# EAGLE design BespokeToast_Rev-0_v77 (EAGLE 9.7.0)

## Sheet 1 of 4: POWER SUPPLY
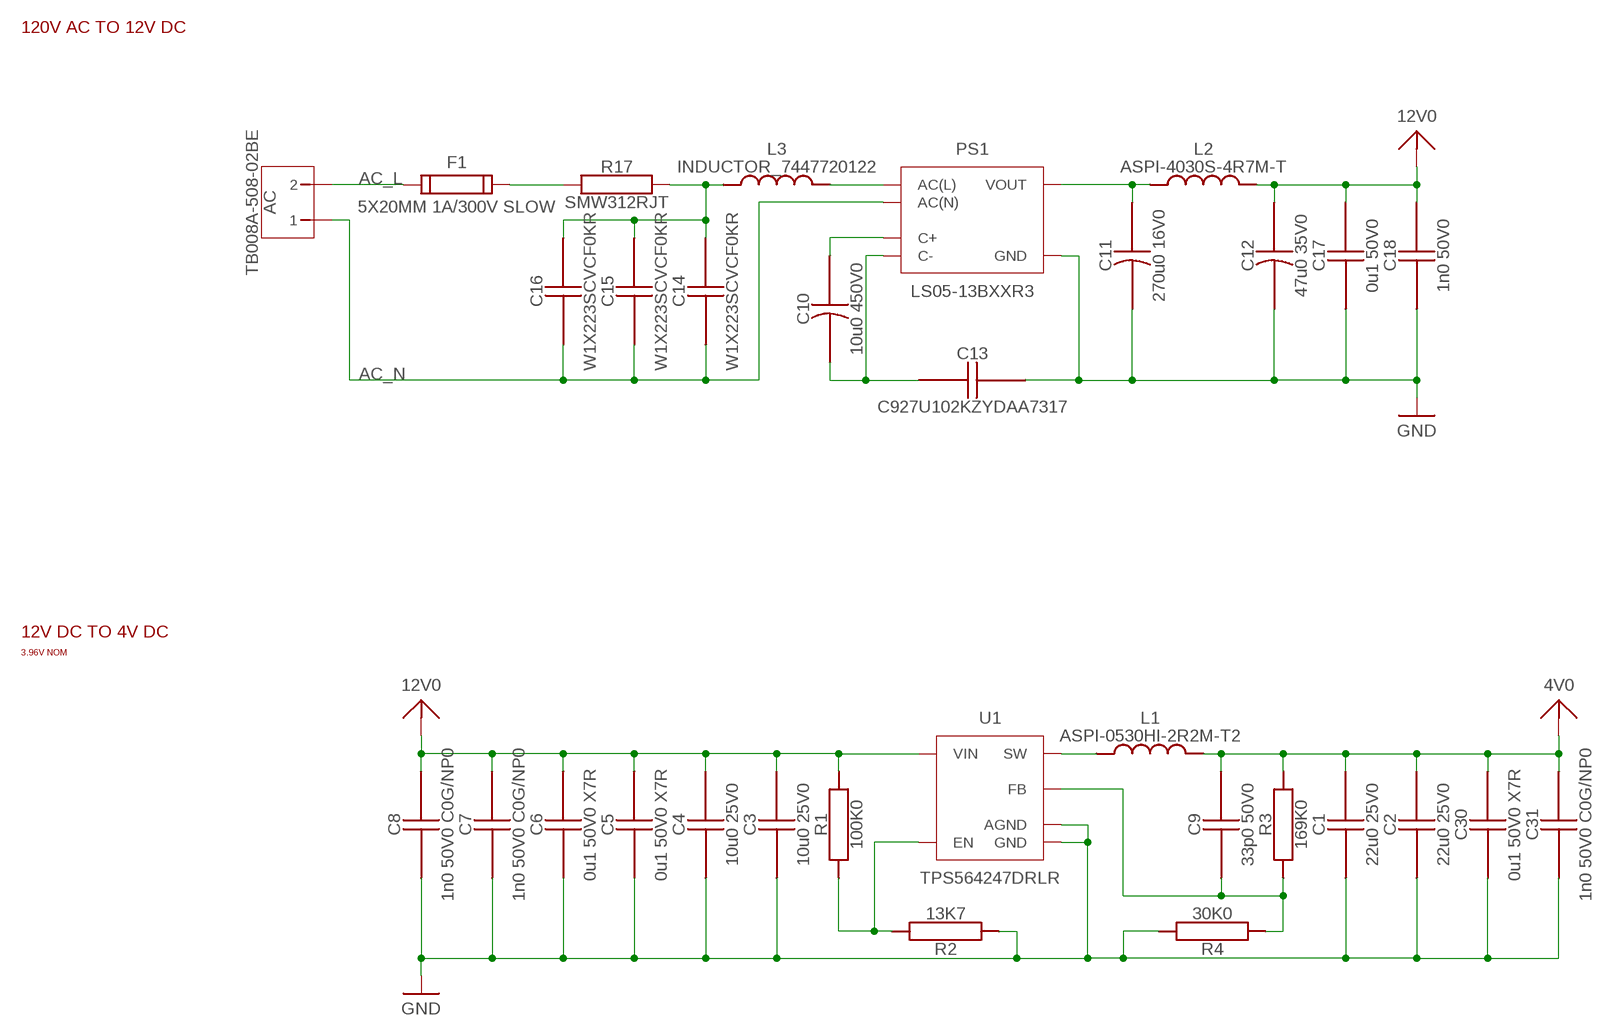
[diagram p0: schematic, sheet 1]

### Parts
AC  TB008A-508-02BE  [TB008A-508-02BE]
C1  22u0 25V0  CAP-NON-POL_SAMSUNG-0805  [SAMSUNG_CAP-0805]
C2  22u0 25V0  CAP-NON-POL_SAMSUNG-0805  [SAMSUNG_CAP-0805]
C3  10u0 25V0  CAP-NON-POL_SAMSUNG-0805  [SAMSUNG_CAP-0805]
C4  10u0 25V0  CAP-NON-POL_SAMSUNG-0805  [SAMSUNG_CAP-0805]
C5  0u1 50V0 X7R  CAP-NON-POL_SAMSUNG-0402  [SAMSUNG_CAP-0402]
C6  0u1 50V0 X7R  CAP-NON-POL_SAMSUNG-0402  [SAMSUNG_CAP-0402]
C7  1n0 50V0 C0G/NP0  CAP-NON-POL_SAMSUNG-0402  [SAMSUNG_CAP-0402]
C8  1n0 50V0 C0G/NP0  CAP-NON-POL_SAMSUNG-0402  [SAMSUNG_CAP-0402]
C9  33p0 50V0  CAP-NON-POL_SAMSUNG-0402  [SAMSUNG_CAP-0402]
C10  10u0 450V0  CAP-POL_RUBYCON_CAP-POL-5X10  [RUBYCON_CAP-POL-5X10]
C11  270u0 16V0  CAP-POL_RUBYCON_CAP-POL-3.5X8  [RUBYCON_CAP-POL-3.5X8]
C12  47u0 35V0  CAP-POL_RUBYCON_CAP-POL-3.5X8  [RUBYCON_CAP-POL-3.5X8]
C13  C927U102KZYDAA7317  CAP-NON-POL_TC_CAP-7.5  [TH_CAP-7.5]
C14  W1X223SCVCF0KR  CAP-NON-POL_TC_CAP-7.5  [TH_CAP-7.5]
C15  W1X223SCVCF0KR  CAP-NON-POL_TC_CAP-7.5  [TH_CAP-7.5]
C16  W1X223SCVCF0KR  CAP-NON-POL_TC_CAP-7.5  [TH_CAP-7.5]
C17  0u1 50V0  CAP-NON-POL_SAMSUNG-0402  [SAMSUNG_CAP-0402]
C18  1n0 50V0  CAP-NON-POL_SAMSUNG-0402  [SAMSUNG_CAP-0402]
C30  0u1 50V0 X7R  CAP-NON-POL_SAMSUNG-0402  [SAMSUNG_CAP-0402]
C31  1n0 50V0 C0G/NP0  CAP-NON-POL_SAMSUNG-0402  [SAMSUNG_CAP-0402]
F1  5X20MM 1A/300V SLOW  FUSE_FC-203-22-5X20MM  [FC-203-22]
L1  ASPI-0530HI-2R2M-T2  INDUCTOR_ASPI-0530HI-2R2M-T2  [ASPI-0530HI-2R2M-T2]
L2  ASPI-4030S-4R7M-T  INDUCTOR_ASPI-4030S-4R7M-T  [ASPI-4030S-4R7M-T]
L3  INDUCTOR_7447720122  [7447720122]
PS1  LS05-13BXXR3  [LS05-13BXXR3]
R1  100K0  RES-CHIP_YAGEO-0402  [YAGEO_RES-0402]
R2  13K7  RES-CHIP_YAGEO-0402  [YAGEO_RES-0402]
R3  169K0  RES-CHIP_YAGEO-0402  [YAGEO_RES-0402]
R4  30K0  RES-CHIP_YAGEO-0402  [YAGEO_RES-0402]
R17  SMW312RJT  [SMW312RJT]
U1  TPS564247DRLR  [TPS564247DRLR]

### Nets
4V0: C1.P$2 C2.P$2 C9.P$2 C30.P$2 C31.P$2 L1.P$2 R3.P$2 ; supply symbol labelled SYM-4V0 ; also sheet 3,4
12V0: C3.P$2 C4.P$2 C5.P$2 C6.P$2 C7.P$2 C8.P$2 C12.+ C17.P$2 C18.P$2 L2.P$2 R1.P$2 U1.P$1(VIN) ; supply symbol labelled SYM-12V0 ; also sheet 2
AC_L: AC.P$2 F1.P$1 F1.P$2 ; also sheet 2
AC_N: AC.P$1 C14.P$1 C15.P$1 C16.P$1 PS1.P$2(AC(N)) ; also sheet 2
GND: C1.P$1 C2.P$1 C3.P$1 C4.P$1 C5.P$1 C6.P$1 C7.P$1 C8.P$1 C11.- C12.- C13.P$2 C17.P$1 C18.P$1 C30.P$1 C31.P$1 PS1.P$5(GND) R2.P$1 R4.P$2 U1.P$3(GND) U1.P$4(AGND) ; supply symbol labelled SYM-GND ; also sheet 2,3,4
N$2: R1.P$1 R2.P$2 U1.P$5(EN)
N$3: C10.+ PS1.P$3(C+)
N$4: C10.- C13.P$1 PS1.P$4(C-)
N$6: C11.+ L2.P$1 PS1.P$6(VOUT)
N$8: F1.P$3 F1.P$4 R17.P$2
N$9: C9.P$1 R3.P$1 R4.P$1 U1.P$6(FB)
N$10: C14.P$2 C15.P$2 C16.P$2 L3.P$1 R17.P$1
N$11: L3.P$2 PS1.P$1(AC(L))
OUT: L1.P$1 U1.P$2(SW)

### Notes on the sheet
- 120V AC TO 12V DC
- 12V DC TO 4V DC
- 3.96V NOM

## Sheet 2 of 4: POWER
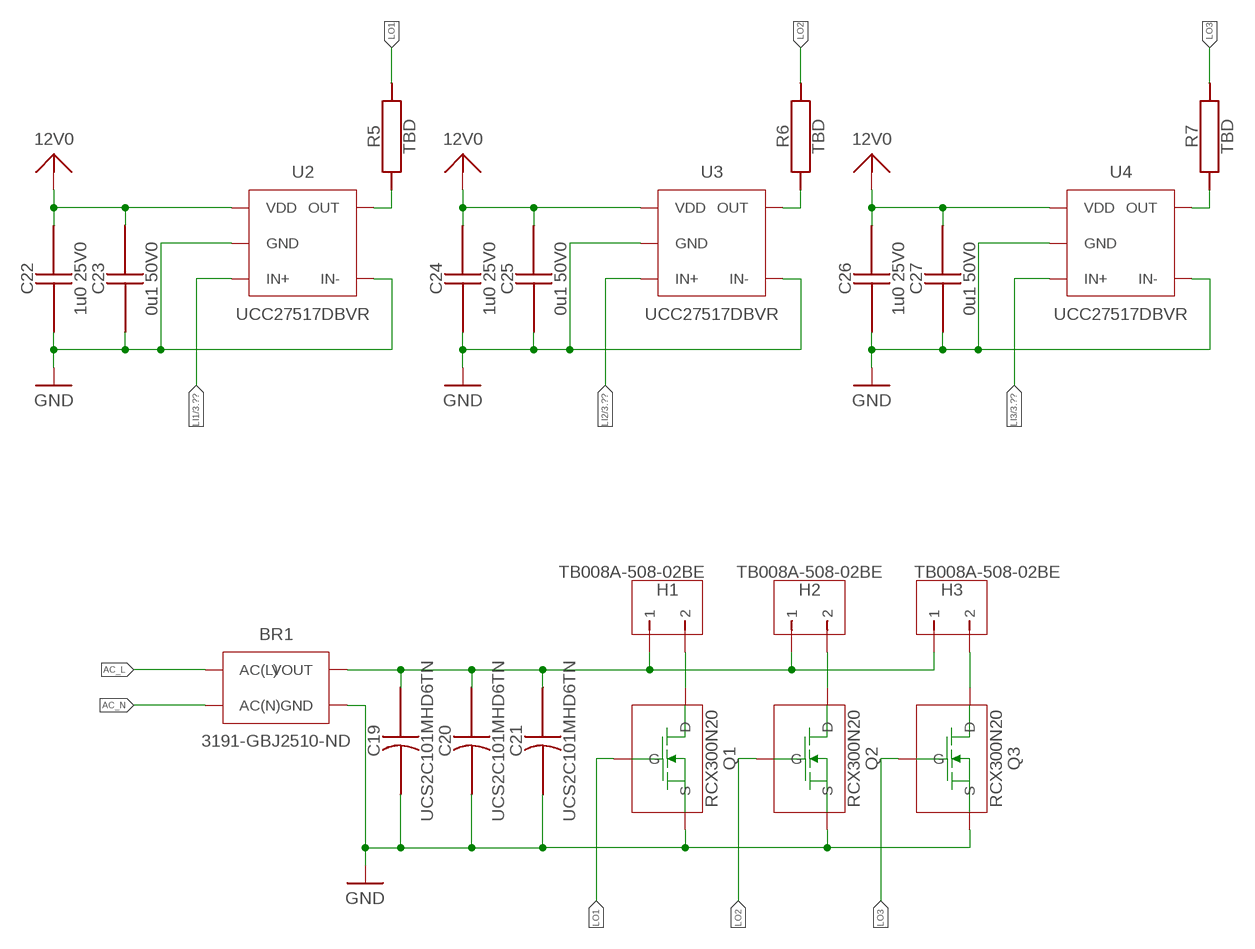
[diagram p1: schematic, sheet 2]

### Parts
BR1  3191-GBJ2510-ND  GBJ2510  [GBJ2510]
C19  UCS2C101MHD6TN  CAP-POL_RUBYCON_CAP-POL-7.5X16  [RUBYCON_CAP-POL-7.5X16]
C20  UCS2C101MHD6TN  CAP-POL_RUBYCON_CAP-POL-7.5X16  [RUBYCON_CAP-POL-7.5X16]
C21  UCS2C101MHD6TN  CAP-POL_RUBYCON_CAP-POL-7.5X16  [RUBYCON_CAP-POL-7.5X16]
C22  1u0 25V0  CAP-NON-POL_SAMSUNG-0805  [SAMSUNG_CAP-0805]
C23  0u1 50V0  CAP-NON-POL_SAMSUNG-0402  [SAMSUNG_CAP-0402]
C24  1u0 25V0  CAP-NON-POL_SAMSUNG-0805  [SAMSUNG_CAP-0805]
C25  0u1 50V0  CAP-NON-POL_SAMSUNG-0402  [SAMSUNG_CAP-0402]
C26  1u0 25V0  CAP-NON-POL_SAMSUNG-0805  [SAMSUNG_CAP-0805]
C27  0u1 50V0  CAP-NON-POL_SAMSUNG-0402  [SAMSUNG_CAP-0402]
H1  TB008A-508-02BE  [TB008A-508-02BE]
H2  TB008A-508-02BE  [TB008A-508-02BE]
H3  TB008A-508-02BE  [TB008A-508-02BE]
Q1  RCX300N20  FET-NCH_FET_TO220-VTH  [FET_TO220-VTH]
Q2  RCX300N20  FET-NCH_FET_TO220-VTH  [FET_TO220-VTH]
Q3  RCX300N20  FET-NCH_FET_TO220-VTH  [FET_TO220-VTH]
R5  TBD  RES-CHIP_YAGEO-0402  [YAGEO_RES-0402]
R6  TBD  RES-CHIP_YAGEO-0402  [YAGEO_RES-0402]
R7  TBD  RES-CHIP_YAGEO-0402  [YAGEO_RES-0402]
U2  UCC27517DBVR  [UCC27517DBVR]
U3  UCC27517DBVR  [UCC27517DBVR]
U4  UCC27517DBVR  [UCC27517DBVR]

### Nets
12V0: C22.P$2 C23.P$2 C24.P$2 C25.P$2 C26.P$2 C27.P$2 U2.P$1(VDD) U3.P$1(VDD) U4.P$1(VDD) ; supply symbol labelled SYM-12V0 ; also sheet 1
AC_L: BR1.P$2(AC(L)) ; also sheet 1
AC_N: BR1.P$3(AC(N)) ; also sheet 1
GND: BR1.P$4(GND) C19.- C20.- C21.- C22.P$1 C23.P$1 C24.P$1 C25.P$1 C26.P$1 C27.P$1 Q1.S Q2.S Q3.S U2.P$2(GND) U2.P$4(IN-) U3.P$2(GND) U3.P$4(IN-) U4.P$2(GND) U4.P$4(IN-) ; supply symbol labelled SYM-GND ; also sheet 1,3,4
LI1: U2.P$3(IN+) ; also sheet 3
LI2: U3.P$3(IN+) ; also sheet 3
LI3: U4.P$3(IN+) ; also sheet 3
LO1: Q1.G R5.P$2
LO2: Q2.G R6.P$2
LO3: Q3.G R7.P$2
N$1: H1.P$2 Q1.D
N$5: H2.P$2 Q2.D
N$12: H3.P$2 Q3.D
N$14: BR1.P$1(VOUT) C19.+ C20.+ C21.+ H1.P$1 H2.P$1 H3.P$1
N$16: R6.P$1 U3.P$5(OUT)
N$17: R5.P$1 U2.P$5(OUT)
N$21: R7.P$1 U4.P$5(OUT)

## Sheet 3 of 4: LOGIC
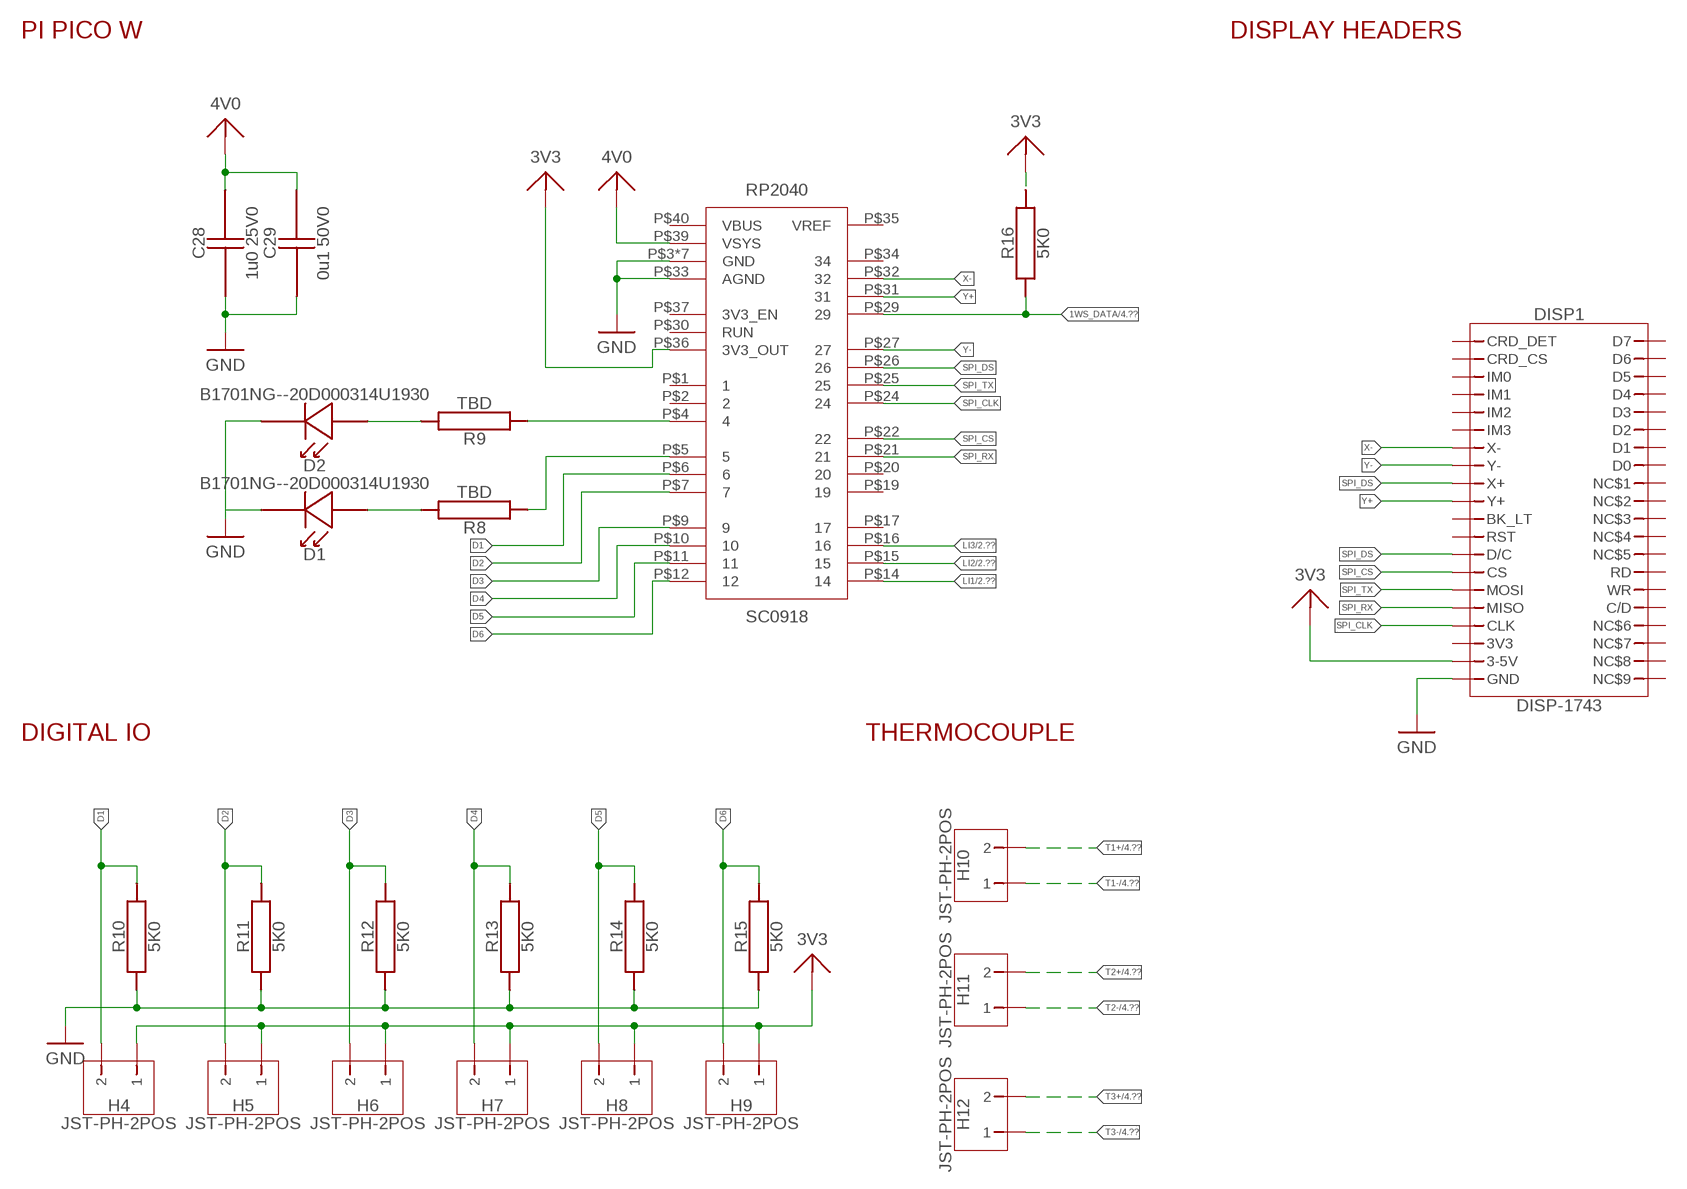
[diagram p2: schematic, sheet 3]

### Parts
C28  1u0 25V0  CAP-NON-POL_SAMSUNG-0805  [SAMSUNG_CAP-0805]
C29  0u1 50V0  CAP-NON-POL_SAMSUNG-0402  [SAMSUNG_CAP-0402]
D1  B1701NG--20D000314U1930  DIODE-LED_B1701NG--20D000314U1930  [B1701NG--20D000314U1930]
D2  B1701NG--20D000314U1930  DIODE-LED_B1701NG--20D000314U1930  [B1701NG--20D000314U1930]
DISP1  DISP-1743  [DISP-1743]
H4  JST-PH-2POS  [JST-PH-2POS]
H5  JST-PH-2POS  [JST-PH-2POS]
H6  JST-PH-2POS  [JST-PH-2POS]
H7  JST-PH-2POS  [JST-PH-2POS]
H8  JST-PH-2POS  [JST-PH-2POS]
H9  JST-PH-2POS  [JST-PH-2POS]
H10  JST-PH-2POS  [JST-PH-2POS]
H11  JST-PH-2POS  [JST-PH-2POS]
H12  JST-PH-2POS  [JST-PH-2POS]
R8  TBD  RES-CHIP_YAGEO-0402  [YAGEO_RES-0402]
R9  TBD  RES-CHIP_YAGEO-0402  [YAGEO_RES-0402]
R10  5K0  RES-CHIP_YAGEO-0402  [YAGEO_RES-0402]
R11  5K0  RES-CHIP_YAGEO-0402  [YAGEO_RES-0402]
R12  5K0  RES-CHIP_YAGEO-0402  [YAGEO_RES-0402]
R13  5K0  RES-CHIP_YAGEO-0402  [YAGEO_RES-0402]
R14  5K0  RES-CHIP_YAGEO-0402  [YAGEO_RES-0402]
R15  5K0  RES-CHIP_YAGEO-0402  [YAGEO_RES-0402]
R16  5K0  RES-CHIP_YAGEO-0402  [YAGEO_RES-0402]
RP2040  SC0918  SC0915  [SC0915]

### Nets
1WS_DATA: R16.P$1 RP2040.P$29 ; also sheet 4
3V3: DISP1.P$19(3-5V) H4.P$1 H5.P$1 H6.P$1 H7.P$1 H8.P$1 H9.P$1 R16.P$2 RP2040.P$36(3V3_OUT) ; supply symbol labelled SYM-3V3
4V0: C28.P$2 C29.P$2 RP2040.P$39(VSYS) ; supply symbol labelled SYM-4V0 ; also sheet 1,4
D1: H4.P$2 R10.P$2 RP2040.P$6
D2: H5.P$2 R11.P$2 RP2040.P$7
D3: H6.P$2 R12.P$2 RP2040.P$9
D4: H7.P$2 R13.P$2 RP2040.P$10
D5: H8.P$2 R14.P$2 RP2040.P$11
D6: H9.P$2 R15.P$2 RP2040.P$12
GND: C28.P$1 C29.P$1 D1.P$1(VSS) D2.P$1(VSS) DISP1.P$20(GND) R10.P$1 R11.P$1 R12.P$1 R13.P$1 R14.P$1 R15.P$1 RP2040.P$3(GND) RP2040.P$8(GND) RP2040.P$13(GND) RP2040.P$18(GND) RP2040.P$23(GND) RP2040.P$28(GND) RP2040.P$33(AGND) RP2040.P$38(GND) ; supply symbol labelled SYM-GND ; also sheet 1,2,4
LI1: RP2040.P$14 ; also sheet 2
LI2: RP2040.P$15 ; also sheet 2
LI3: RP2040.P$16 ; also sheet 2
N$7: D1.P$2(VDD) R8.P$2
N$13: D2.P$2(VDD) R9.P$2
N$15: R8.P$1 RP2040.P$5
N$18: R9.P$1 RP2040.P$4
SPI_CLK: DISP1.P$17(CLK) RP2040.P$24
SPI_CS: DISP1.P$14(CS) RP2040.P$22
SPI_DS: DISP1.P$9(X+) DISP1.P$13(D/C) RP2040.P$26
SPI_RX: DISP1.P$16(MISO) RP2040.P$21
SPI_TX: DISP1.P$15(MOSI) RP2040.P$25
T1+: H10.P$2 ; also sheet 4
T1-: H10.P$1 ; also sheet 4
T2+: H11.P$2 ; also sheet 4
T2-: H11.P$1 ; also sheet 4
T3+: H12.P$2 ; also sheet 4
T3-: H12.P$1 ; also sheet 4
X-: DISP1.P$7(X-) RP2040.P$32
Y+: DISP1.P$10(Y+) RP2040.P$31
Y-: DISP1.P$8(Y-) RP2040.P$27
Unconnected: DISP1.P$1(CRD_DET) DISP1.P$2(CRD_CS) DISP1.P$3(IM0) DISP1.P$4(IM1) DISP1.P$5(IM2) DISP1.P$6(IM3) DISP1.P$11(BK_LT) DISP1.P$12(RST) DISP1.P$18(3V3) DISP1.P$21(NC$9) DISP1.P$22(NC$8) DISP1.P$23(NC$7) DISP1.P$24(NC$6) DISP1.P$25(C/D) DISP1.P$26(WR) DISP1.P$27(RD) DISP1.P$28(NC$5) DISP1.P$29(NC$4) DISP1.P$30(NC$3) DISP1.P$31(NC$2) DISP1.P$32(NC$1) DISP1.P$33(D0) DISP1.P$34(D1) DISP1.P$35(D2) DISP1.P$36(D3) DISP1.P$37(D4) DISP1.P$38(D5) DISP1.P$39(D6) DISP1.P$40(D7) RP2040.P$1 RP2040.P$2 RP2040.P$17 RP2040.P$19 RP2040.P$20 RP2040.P$30(RUN) RP2040.P$34 RP2040.P$35(VREF) RP2040.P$37(3V3_EN) RP2040.P$40(VBUS)

### Notes on the sheet
- PI PICO W | DISPLAY HEADERS
- DIGITAL IO | THERMOCOUPLE

## Sheet 4 of 4: THERMOCOUPLE ADC
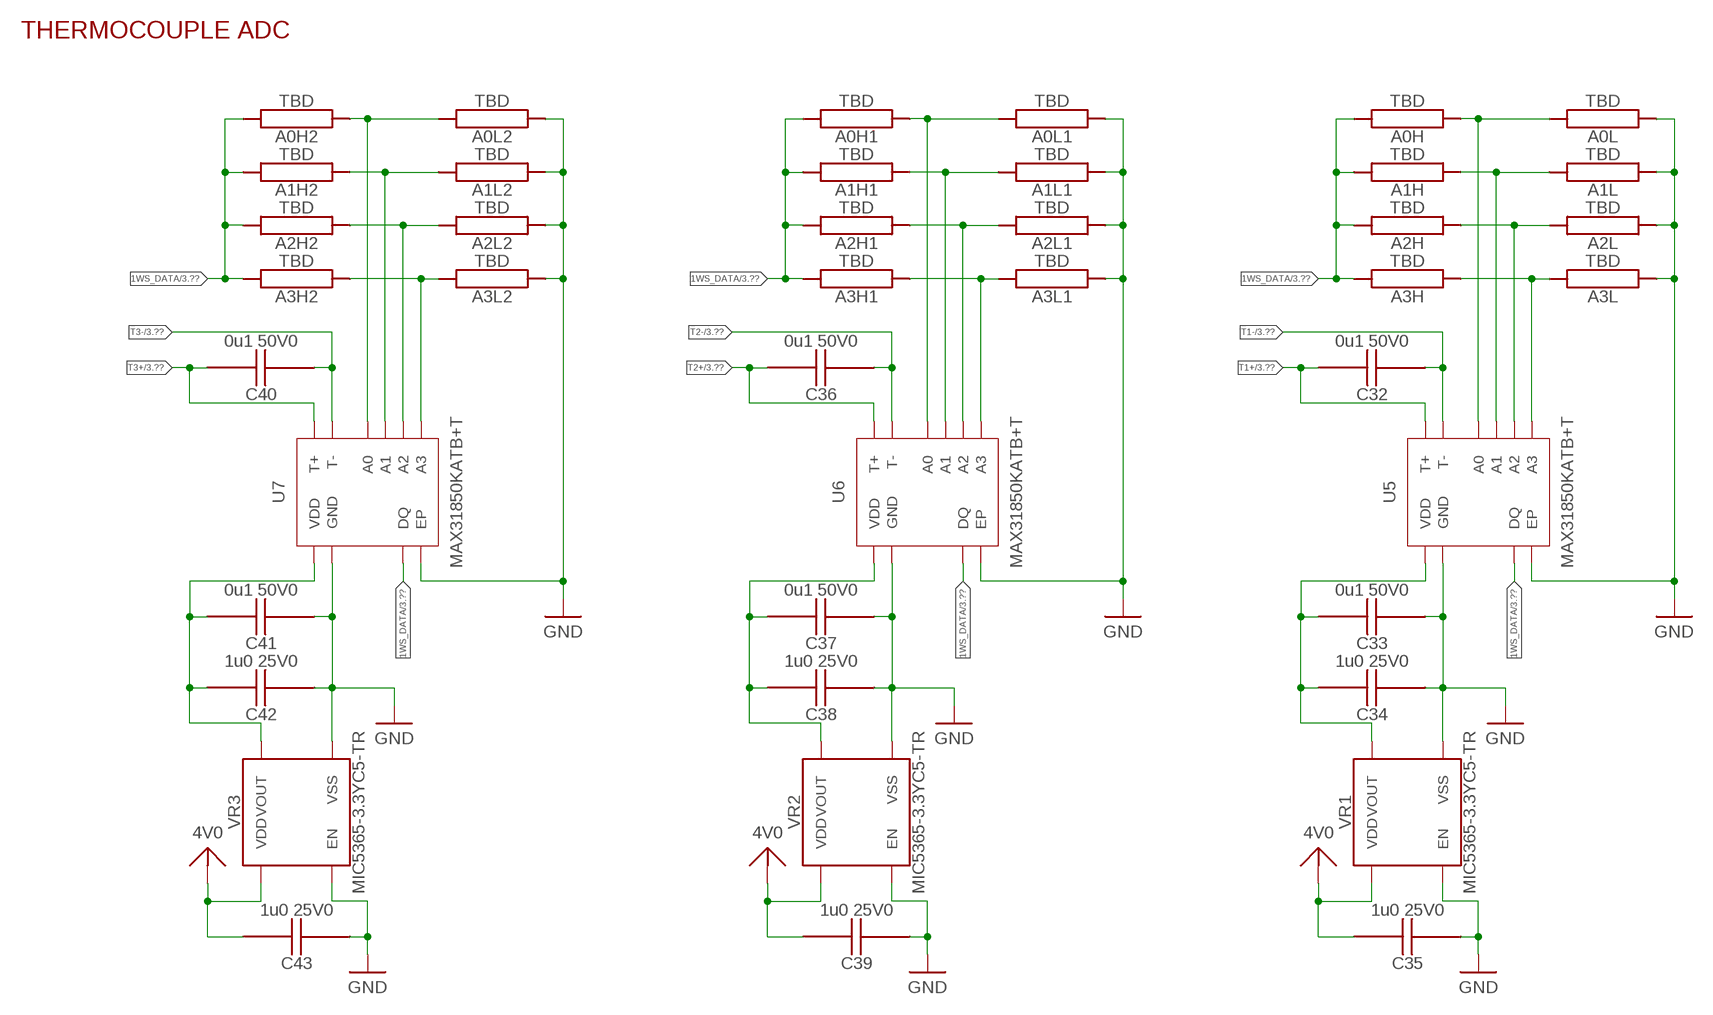
[diagram p3: schematic, sheet 4]

### Parts
A0H  TBD  RES-CHIP_YAGEO-0402  [YAGEO_RES-0402]
A0H1  TBD  RES-CHIP_YAGEO-0402  [YAGEO_RES-0402]
A0H2  TBD  RES-CHIP_YAGEO-0402  [YAGEO_RES-0402]
A0L  TBD  RES-CHIP_YAGEO-0402  [YAGEO_RES-0402]
A0L1  TBD  RES-CHIP_YAGEO-0402  [YAGEO_RES-0402]
A0L2  TBD  RES-CHIP_YAGEO-0402  [YAGEO_RES-0402]
A1H  TBD  RES-CHIP_YAGEO-0402  [YAGEO_RES-0402]
A1H1  TBD  RES-CHIP_YAGEO-0402  [YAGEO_RES-0402]
A1H2  TBD  RES-CHIP_YAGEO-0402  [YAGEO_RES-0402]
A1L  TBD  RES-CHIP_YAGEO-0402  [YAGEO_RES-0402]
A1L1  TBD  RES-CHIP_YAGEO-0402  [YAGEO_RES-0402]
A1L2  TBD  RES-CHIP_YAGEO-0402  [YAGEO_RES-0402]
A2H  TBD  RES-CHIP_YAGEO-0402  [YAGEO_RES-0402]
A2H1  TBD  RES-CHIP_YAGEO-0402  [YAGEO_RES-0402]
A2H2  TBD  RES-CHIP_YAGEO-0402  [YAGEO_RES-0402]
A2L  TBD  RES-CHIP_YAGEO-0402  [YAGEO_RES-0402]
A2L1  TBD  RES-CHIP_YAGEO-0402  [YAGEO_RES-0402]
A2L2  TBD  RES-CHIP_YAGEO-0402  [YAGEO_RES-0402]
A3H  TBD  RES-CHIP_YAGEO-0402  [YAGEO_RES-0402]
A3H1  TBD  RES-CHIP_YAGEO-0402  [YAGEO_RES-0402]
A3H2  TBD  RES-CHIP_YAGEO-0402  [YAGEO_RES-0402]
A3L  TBD  RES-CHIP_YAGEO-0402  [YAGEO_RES-0402]
A3L1  TBD  RES-CHIP_YAGEO-0402  [YAGEO_RES-0402]
A3L2  TBD  RES-CHIP_YAGEO-0402  [YAGEO_RES-0402]
C32  0u1 50V0  CAP-NON-POL_SAMSUNG-0402  [SAMSUNG_CAP-0402]
C33  0u1 50V0  CAP-NON-POL_SAMSUNG-0402  [SAMSUNG_CAP-0402]
C34  1u0 25V0  CAP-NON-POL_SAMSUNG-0603  [SAMSUNG_CAP-0603]
C35  1u0 25V0  CAP-NON-POL_SAMSUNG-0603  [SAMSUNG_CAP-0603]
C36  0u1 50V0  CAP-NON-POL_SAMSUNG-0402  [SAMSUNG_CAP-0402]
C37  0u1 50V0  CAP-NON-POL_SAMSUNG-0402  [SAMSUNG_CAP-0402]
C38  1u0 25V0  CAP-NON-POL_SAMSUNG-0603  [SAMSUNG_CAP-0603]
C39  1u0 25V0  CAP-NON-POL_SAMSUNG-0603  [SAMSUNG_CAP-0603]
C40  0u1 50V0  CAP-NON-POL_SAMSUNG-0402  [SAMSUNG_CAP-0402]
C41  0u1 50V0  CAP-NON-POL_SAMSUNG-0402  [SAMSUNG_CAP-0402]
C42  1u0 25V0  CAP-NON-POL_SAMSUNG-0603  [SAMSUNG_CAP-0603]
C43  1u0 25V0  CAP-NON-POL_SAMSUNG-0603  [SAMSUNG_CAP-0603]
U5  MAX31850KATB+T  MAX31850_MAX31850KATB+T  [MAX31850]
U6  MAX31850KATB+T  MAX31850_MAX31850KATB+T  [MAX31850]
U7  MAX31850KATB+T  MAX31850_MAX31850KATB+T  [MAX31850]
VR1  MIC5365-3.3YC5-TR  MIC5365-3.3YC5-TR"  [MIC5365-3.3YC5-TR]
VR2  MIC5365-3.3YC5-TR  MIC5365-3.3YC5-TR"  [MIC5365-3.3YC5-TR]
VR3  MIC5365-3.3YC5-TR  MIC5365-3.3YC5-TR"  [MIC5365-3.3YC5-TR]

### Nets
1WS_DATA: A0H1.P$2 A0H2.P$2 A0H.P$2 A1H1.P$2 A1H2.P$2 A1H.P$2 A2H1.P$2 A2H2.P$2 A2H.P$2 A3H1.P$2 A3H2.P$2 A3H.P$2 U5.P$5(DQ) U6.P$5(DQ) U7.P$5(DQ) ; also sheet 3
4V0: C35.P$2 C39.P$2 C43.P$2 VR1.P$1(VDD) VR2.P$1(VDD) VR3.P$1(VDD) ; supply symbol labelled SYM-4V0 ; also sheet 1,3
GND: A0L1.P$1 A0L2.P$1 A0L.P$1 A1L1.P$1 A1L2.P$1 A1L.P$1 A2L1.P$1 A2L2.P$1 A2L.P$1 A3L1.P$1 A3L2.P$1 A3L.P$1 C33.P$1 C34.P$1 C35.P$1 C37.P$1 C38.P$1 C39.P$1 C41.P$1 C42.P$1 C43.P$1 U5.EP U5.P$1(GND) U6.EP U6.P$1(GND) U7.EP U7.P$1(GND) VR1.P$2(VSS) VR1.P$3(EN) VR2.P$2(VSS) VR2.P$3(EN) VR3.P$2(VSS) VR3.P$3(EN) ; supply symbol labelled SYM-GND ; also sheet 1,2,3
N$19: A0H.P$1 A0L.P$2 U5.P$6(A0)
N$20: A1H.P$1 A1L.P$2 U5.P$7(A1)
N$22: A2H.P$1 A2L.P$2 U5.P$8(A2)
N$23: A3H.P$1 A3L.P$2 U5.P$9(A3)
N$24: A0H1.P$1 A0L1.P$2 U6.P$6(A0)
N$25: A1H1.P$1 A1L1.P$2 U6.P$7(A1)
N$26: A2H1.P$1 A2L1.P$2 U6.P$8(A2)
N$27: A3H1.P$1 A3L1.P$2 U6.P$9(A3)
N$28: C33.P$2 C34.P$2 U5.P$4(VDD) VR1.P$5(VOUT)
N$29: C37.P$2 C38.P$2 U6.P$4(VDD) VR2.P$5(VOUT)
N$30: A0H2.P$1 A0L2.P$2 U7.P$6(A0)
N$31: A1H2.P$1 A1L2.P$2 U7.P$7(A1)
N$32: A2H2.P$1 A2L2.P$2 U7.P$8(A2)
N$33: A3H2.P$1 A3L2.P$2 U7.P$9(A3)
N$34: C41.P$2 C42.P$2 U7.P$4(VDD) VR3.P$5(VOUT)
T1+: C32.P$2 U5.P$3(T+) ; also sheet 3
T1-: C32.P$1 U5.P$2(T-) ; also sheet 3
T2+: C36.P$2 U6.P$3(T+) ; also sheet 3
T2-: C36.P$1 U6.P$2(T-) ; also sheet 3
T3+: C40.P$2 U7.P$3(T+) ; also sheet 3
T3-: C40.P$1 U7.P$2(T-) ; also sheet 3

### Notes on the sheet
- THERMOCOUPLE ADC

## Library data of the parts
A0H A0H1 A0H2 A0L A0L1 A0L2 A1H A1H1 A1H2 A1L A1L1 A1L2 A2H A2H1 A2H2 A2L A2L1 A2L2 A3H A3H1 A3H2 A3L A3L1 A3L2 = VOSTOK_KRAETON_LIB:RES-CHIP; SPICEPREFIX: B
AC H1-H3 = VOSTOK_MISC_LIB:TB008A-508-02BE
BR1 = VOSTOK_MISC_LIB:GBJ2510
C1-C9 C13-C18 C22-C31 = VOSTOK_KRAETON_LIB:CAP-NON-POL
C10-C12 C19-C21 = VOSTOK_KRAETON_LIB:CAP-POL
C32-C43 = VOSTOK_KRAETON_LIB:CAP-NON-POL; SPICEPREFIX: C
D1 D2 = VOSTOK_KRAETON_LIB:DIODE-LED
DISP1 = VOSTOK_MISC_LIB:DISP-1743
F1 = VOSTOK_KRAETON_LIB:FUSE
H4-H12 = VOSTOK_MISC_LIB:JST-PH-2POS
L1-L3 = VOSTOK_KRAETON_LIB:INDUCTOR
PS1 = VOSTOK_MISC_LIB:LS05-13BXXR3
Q1-Q3 = VOSTOK_KRAETON_LIB:FET-NCH
R1-R16 = VOSTOK_KRAETON_LIB:RES-CHIP
R17 = VOSTOK_MISC_LIB:SMW312RJT
RP2040 = VOSTOK_MISC_LIB:SC0915
U1 = VOSTOK_KRAETON_LIB:TPS564247DRLR
U2-U4 = VOSTOK_KRAETON_LIB:UCC27517DBVR
U5-U7 = VOSTOK_KRAETON_LIB:MAX31850; SPICEPREFIX: X
VR1-VR3 = VOSTOK_KRAETON_LIB:MIC5365-3.3YC5-TR; SPICEPREFIX: E

## Board
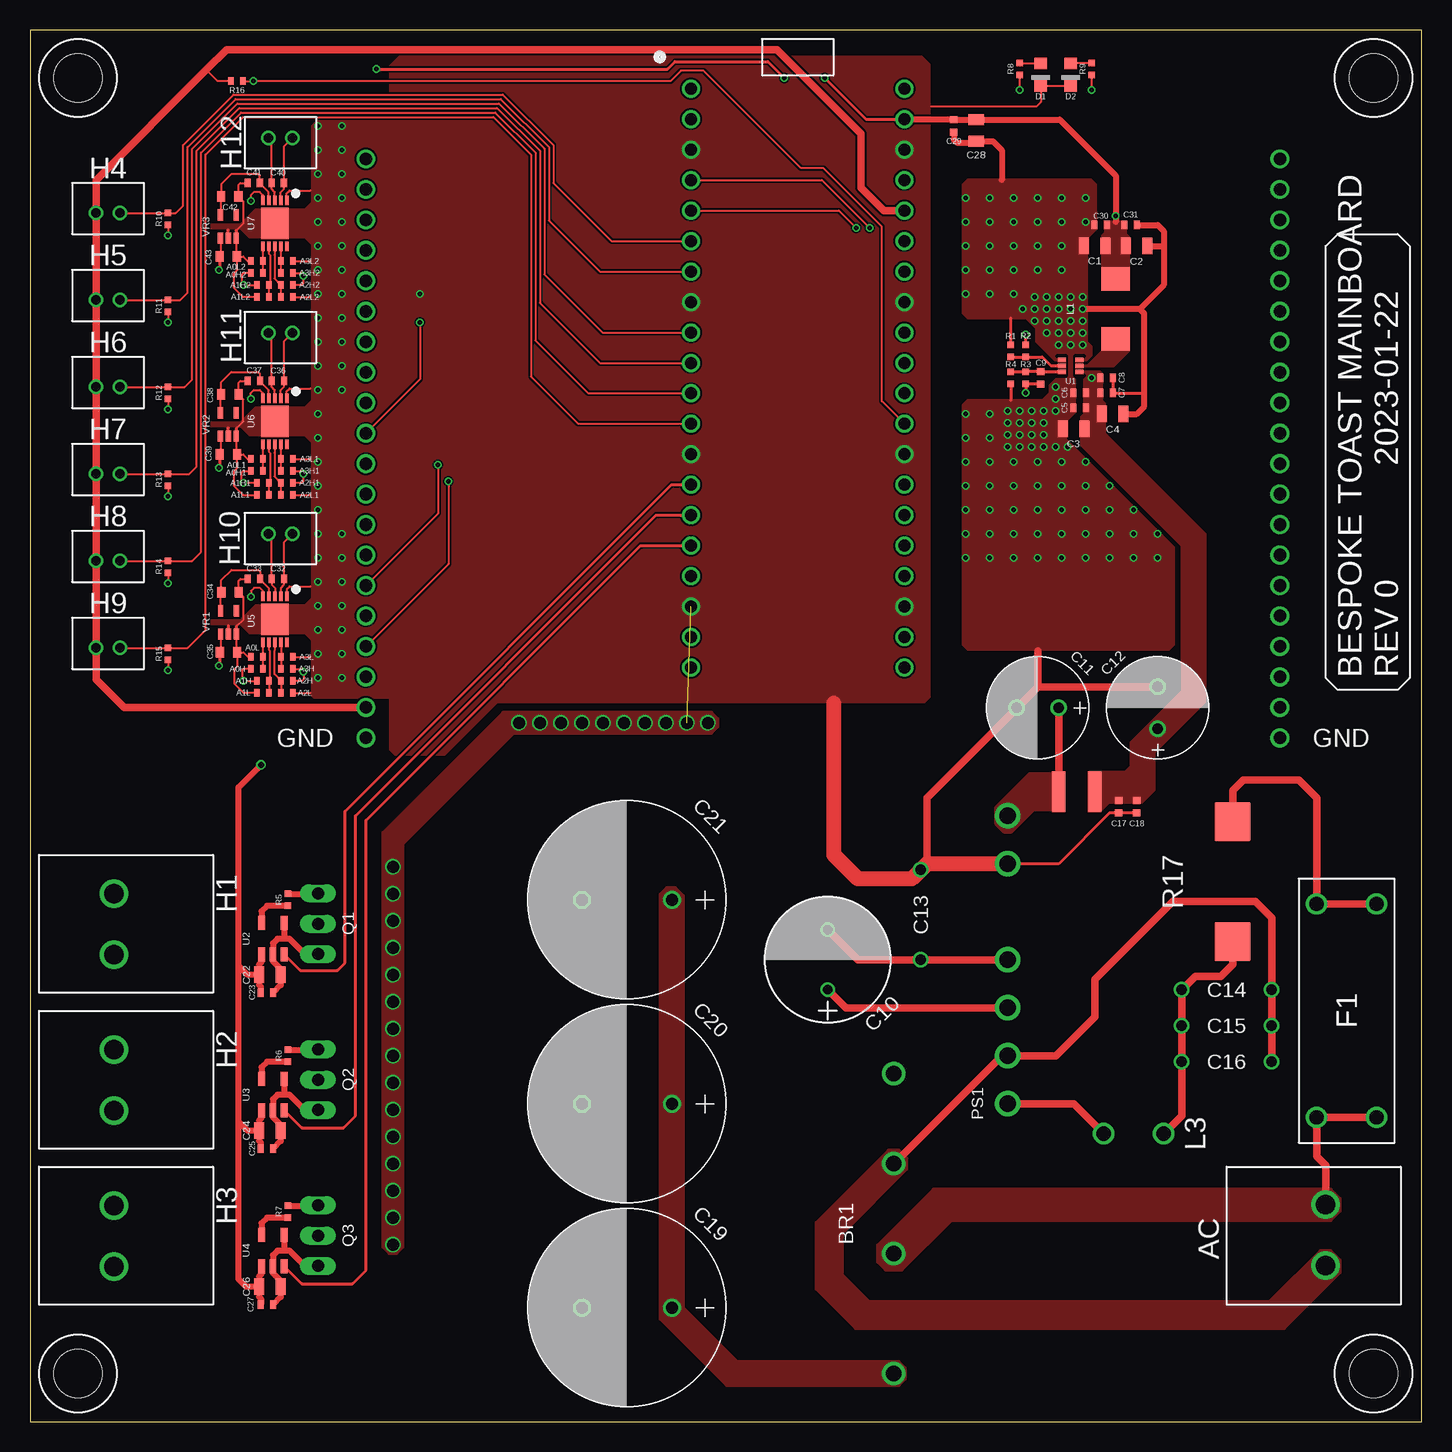
[diagram p4: board, top side]
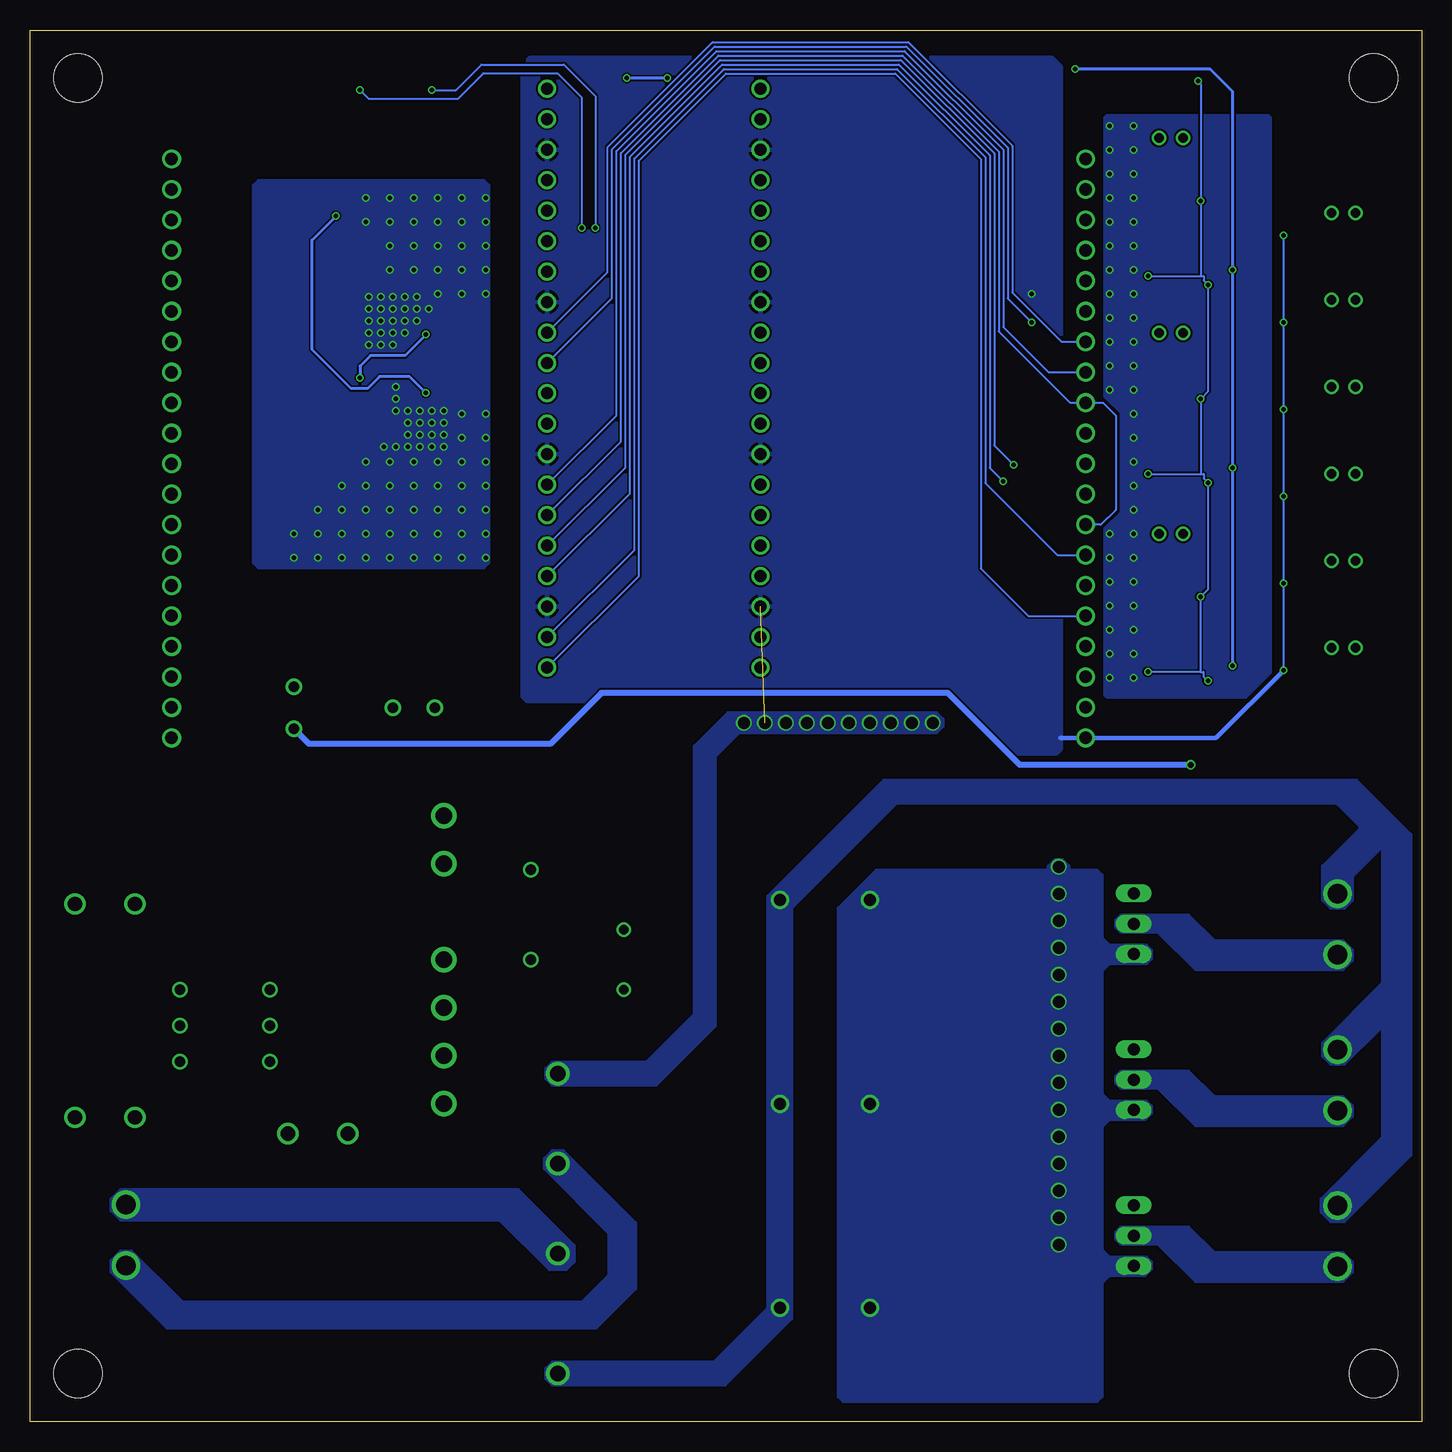
[diagram p5: board, bottom side, seen from below]

Size 116 x 116 mm. Coordinates in mm from the lower left corner, seen from the top.
Outline: 0,0 116,0 116,116 0,116 0,0
Copper layers (1*16): Top 0.035mm / dielectric 1.5mm / Bottom 0.035mm
Design rules "default *": minimum track width 6mil, minimum drill 0.2mm, track to track 6mil, track to pad 8mil, pad to pad 5mil, via to via 6mil, smd to smd 0mil, copper to edge 0.3mm, drill to drill 0.5mm, minimum pad ring 0.13mm, minimum via ring 0.13mm, stop-mask expansion 4mil, vias tented up to drill 0.35mm, thermal gap 10mil
Holes 4 mm at 112,4 4,4 112,112 4,112

### Footprints (pad centres in the part's own frame; a part is rotated, then mirrored left to right if it is on the bottom)
YAGEO_RES-0402 = smd 0.5 x 0.6: P$1 -0.5,0; P$2 0.5,0
TB008A-508-02BE = drill 1.6: P$1 0,0; P$2 5.08,0
GBJ2510 = drill 1.3: P$1 0,0; P$2 10,0; P$3 17.5,0; P$4 25,0
SAMSUNG_CAP-0805 = smd 0.95 x 1.35: P$1 -0.905,0; P$2 0.905,0
SAMSUNG_CAP-0402 = smd 0.58 x 0.7: P$1 -0.515,0; P$2 0.515,0
RUBYCON_CAP-POL-5X10 = drill 0.8: + 0,2.5; - 0,-2.5
RUBYCON_CAP-POL-3.5X8 = drill 0.9: + 0,1.75; - 0,-1.75
TH_CAP-7.5 = drill 0.85: P$1 0,3.75; P$2 0,-3.75
RUBYCON_CAP-POL-7.5X16 = drill 1: + 0,3.75; - 0,-3.75
SAMSUNG_CAP-0603 = smd 0.76 x 0.85: P$1 -0.72,0; P$2 0.72,0
B1701NG--20D000314U1930 = smd 1.1 x 0.9: P$1 0,0.92; P$2 0,-0.95
DISP-1743 = drill 1.05: P$1 0,0; P$2 0,-2.54; P$3 0,-5.08; P$4 0,-7.62; P$5 0,-10.16; P$6 0,-12.7; P$7 0,-15.24; P$8 0,-17.78; P$9 0,-20.32; P$10 0,-22.86; P$11 0,-25.4; P$12 0,-27.94; P$13 0,-30.48; P$14 0,-33.02; P$15 0,-35.56; P$16 0,-38.1; P$17 0,-40.64; P$18 0,-43.18; P$19 0,-45.72; P$20 0,-48.26; P$21 76.2,-48.26; P$22 76.2,-45.72; P$23 76.2,-43.18; P$24 76.2,-40.64; P$25 76.2,-38.1; P$26 76.2,-35.56; P$27 76.2,-33.02; P$28 76.2,-30.48; P$29 76.2,-27.94; P$30 76.2,-25.4; P$31 76.2,-22.86; P$32 76.2,-20.32; P$33 76.2,-17.78; P$34 76.2,-15.24; P$35 76.2,-12.7; P$36 76.2,-10.16; P$37 76.2,-7.62; P$38 76.2,-5.08; P$39 76.2,-2.54; P$40 76.2,0
FC-203-22 = drill 1.17: P$1 -8.9,2.5; P$2 -8.9,-2.5; P$3 8.9,2.5; P$4 8.9,-2.5
JST-PH-2POS = drill 0.8: P$1 -1,0; P$2 1,0
ASPI-0530HI-2R2M-T2 = smd 2 x 2.5: P$1 -2.5,0; P$2 2.5,0
ASPI-4030S-4R7M-T = smd 1.1 x 3.4: P$1 -1.5,0; P$2 1.5,0
7447720122 = drill 1.2: P$1 -2.5,0; P$2 2.5,0
LS05-13BXXR3 = drill 1.4 slot 2: P$1 0,0; P$2 4,0; P$3 8,0; P$4 12,0; P$5 20,0; P$6 24,0
FET_TO220-VTH = drill 1 long: D 0,0; G -2.54,0; S 2.54,0
SMW312RJT = smd 3.2 x 3: P$1 -5,0; P$2 5,0
SC0915 = drill 1: P$1 -8.89,22.86; P$2 -8.89,20.32; P$3 -8.89,17.78; P$4 -8.89,15.24; P$5 -8.89,12.7; P$6 -8.89,10.16; P$7 -8.89,7.62; P$8 -8.89,5.08; P$9 -8.89,2.54; P$10 -8.89,0; P$11 -8.89,-2.54; P$12 -8.89,-5.08; P$13 -8.89,-7.62; P$14 -8.89,-10.16; P$15 -8.89,-12.7; P$16 -8.89,-15.24; P$17 -8.89,-17.78; P$18 -8.89,-20.32; P$19 -8.89,-22.86; P$20 -8.89,-25.4; P$21 8.89,-25.4; P$22 8.89,-22.86; P$23 8.89,-20.32; P$24 8.89,-17.78; P$25 8.89,-15.24; P$26 8.89,-12.7; P$27 8.89,-10.16; P$28 8.89,-7.62; P$29 8.89,-5.08; P$30 8.89,-2.54; P$31 8.89,0; P$32 8.89,2.54; P$33 8.89,5.08; P$34 8.89,7.62; P$35 8.89,10.16; P$36 8.89,12.7; P$37 8.89,15.24; P$38 8.89,17.78; P$39 8.89,20.32; P$40 8.89,22.86
TPS564247DRLR = smd 0.67 x 0.3: P$1 -0.74,0.5; P$2 -0.74,0; P$3 -0.74,-0.5; P$4 0.74,-0.5; P$5 0.74,0; P$6 0.74,0.5
UCC27517DBVR = smd 1.1 x 0.6: P$1 -1.3,0.95; P$2 -1.3,0; P$3 -1.3,-0.95; P$4 1.3,-0.95; P$5 1.3,0.95
MAX31850 = smd 2.6 x 2.3: EP 0,0 | smd 0.79 x 0.3: P$1 -1.92,1; P$2 -1.92,0.5; P$3 -1.92,0; P$4 -1.92,-0.5; P$5 -1.92,-1; P$6 1.92,-1; P$7 1.92,-0.5; P$8 1.92,0; P$9 1.92,0.5; P$10 1.92,1
MIC5365-3.3YC5-TR = smd 0.45 x 0.95: P$1 0.65,0.975; P$2 0,0.975; P$3 -0.65,0.975; P$4 -0.65,-0.975; P$5 0.65,-0.975

### Placement (x,y rotation side)
A0H  18.92,62.75 180 top
A0H1  18.91,79.25 180 top
A0H2  18.91,95.75 180 top
A0L  18.92,63.75 0 top
A0L1  18.91,80.25 0 top
A0L2  18.91,96.75 0 top
A1H  19.42,61.75 180 top
A1H1  19.41,78.25 180 top
A1H2  19.41,94.75 180 top
A1L  19.42,60.75 0 top
A1L1  19.41,77.25 0 top
A1L2  19.41,93.75 0 top
A2H  21.42,61.75 0 top
A2H1  21.41,78.25 0 top
A2H2  21.41,94.75 0 top
A2L  21.42,60.75 180 top
A2L1  21.41,77.25 180 top
A2L2  21.41,93.75 180 top
A3H  21.42,62.75 0 top
A3H1  21.41,79.25 0 top
A3H2  21.41,95.75 0 top
A3L  21.42,63.75 180 top
A3L1  21.41,80.25 180 top
A3L2  21.41,96.75 180 top
AC  108,13 90 top
BR1  72.01,3.99 90 top
C1  88.75,98 0 top
C2  92.25,98 180 top
C3  87,82.75 0 top
C4  90.25,84 180 top
C5  87.5,84.5 0 top
C6  87.5,85.75 0 top
C7  89.75,85.75 180 top
C8  89.75,87 180 top
C9  84.25,87 270 top
C10  66.5,38.5 180 top
C11  84,59.5 270 top
C12  94,59.5 180 top
C13  74.25,42.25 180 top
C14  99.75,36 270 top
C15  99.75,33 270 top
C16  99.75,30 270 top
C17  90.75,51.25 90 top
C18  92.25,51.25 90 top
C19  49.75,9.5 270 top
C20  49.75,26.5 270 top
C21  49.75,43.5 270 top
C22  20,37.25 180 top
C23  19.75,35.75 180 top
C24  20,24.25 180 top
C25  19.75,22.75 180 top
C26  20,11.25 180 top
C27  19.75,9.75 180 top
C28  78.88,107.62 90 top
C29  77,108 90 top
C30  89.25,99.75 0 top
C31  91.75,99.75 180 top
C32  20.67,70.25 180 top
C33  18.67,70.25 0 top
C34  16.67,69.12 180 top
C35  16.55,64.12 180 top
C36  20.66,86.75 180 top
C37  18.66,86.75 0 top
C38  16.66,85.62 180 top
C39  16.54,80.62 180 top
C40  20.66,103.25 180 top
C41  18.66,103.25 0 top
C42  16.66,102.12 180 top
C43  16.54,97.12 180 top
D1  84.25,112.25 180 top
D2  86.75,112.25 180 top
DISP1  28,105.25 0 top
F1  109.75,34.25 90 top
H1  7,44 270 top
H2  7,31 270 top
H3  7,18 270 top
H4  6.5,100.75 0 top
H5  6.5,93.5 0 top
H6  6.5,86.25 0 top
H7  6.5,79 0 top
H8  6.5,71.75 0 top
H9  6.5,64.5 0 top
H10  20.88,74 180 top
H11  20.88,90.75 180 top
H12  20.88,107 180 top
L1  90.5,92.75 90 top
L2  87.25,52.5 0 top
L3  92,24 180 top
PS1  81.5,26.5 90 top
Q1  24,41.5 270 top
Q2  24,28.5 270 top
Q3  24,15.5 270 top
R1  83,89.25 90 top
R2  81.75,89.25 270 top
R3  83,87 270 top
R4  81.75,87 270 top
R5  21.5,43.5 90 top
R6  21.5,30.5 90 top
R7  21.5,17.5 90 top
R8  82.5,112.75 90 top
R9  88.5,112.75 90 top
R10  11.5,100.25 90 top
R11  11.5,93 90 top
R12  11.5,85.75 90 top
R13  11.5,78.5 90 top
R14  11.5,71.25 90 top
R15  11.5,64 90 top
R16  17.25,111.75 180 top
R17  100.25,45 90 top
RP2040  64,88.25 0 top
U1  86.75,88 180 top
U2  20.25,40.25 90 top
U3  20.25,27.25 90 top
U4  20.25,14.25 90 top
U5  20.42,66.88 270 top
U6  20.41,83.38 270 top
U7  20.41,99.88 270 top
VR1  16.55,66.62 180 top
VR2  16.54,83.12 180 top
VR3  16.54,99.62 180 top

### Tracks (layer width: path | path; a pad name or v marks a point on that pad's centre or on a via)
1WS_DATA  (via drill 0.35)
  Top 0.152: A1H.P$2 v17.8,61.75 17.67,61.88 17.67,62.62 17.8,62.75 A0H.P$2 | A3H.P$2 22.67,62.75 22.8,62.62 v22.8,62.5 22.8,61.88 22.67,61.75 A2H.P$2 | U5.P$5 19.42,69.25 19.17,69.5 18.67,69.5 18.42,69.25 v18.42,68.75 | A1H1.P$2 v17.79,78.25 17.66,78.38 17.66,79.12 17.79,79.25 A0H1.P$2 | A3H1.P$2 22.66,79.25 22.79,79.12 v22.79,79 22.79,78.38 22.66,78.25 A2H1.P$2 | U6.P$5 19.41,85.75 19.16,86 18.66,86 18.41,85.75 v18.41,85.25 | A1H2.P$2 v17.79,94.75 17.66,94.88 17.66,95.62 17.79,95.75 A0H2.P$2 | A3H2.P$2 22.66,95.75 22.79,95.62 v22.79,95.5 22.79,94.88 22.66,94.75 A2H2.P$2 | U7.P$5 19.41,102.25 19.16,102.5 18.66,102.5 18.41,102.25 v18.41,101.75 | RP2040.P$29 71,85.06 71,99.62 66.12,104.5 64.25,104.5 56.12,112.62 54.25,112.62 53.38,111.75 v18.62,111.75 R16.P$1
  Bottom 0.152: 18.42,62.5 v18.42,68.75 17.79,69.38 v17.79,78.25 18.16,78.62 18.16,79 18.41,79 | v17.8,61.75 18.17,62.12 18.17,62.5 18.42,62.5 | 18.42,62.5 v22.8,62.5 | 18.41,79 v18.41,85.25 17.79,85.88 v17.79,94.75 18.16,95.12 18.16,95.5 18.41,95.5 | v22.79,79 18.41,79 | 18.41,95.5 v18.41,101.75 18.41,111.53 v18.62,111.75 | v22.79,95.5 18.41,95.5
3V3
  Top 0.152: R16.P$2 15.62,111.75 14.69,112.69
  Top 0.635: DISP1.P$19 7.84,59.53 5.5,61.88 H9.P$1 H8.P$1 H7.P$1 H6.P$1 H5.P$1 H4.P$1 5.5,103.5 14.69,112.69 16.38,114.38 62.25,114.38 69.25,107.38 69.25,102.88 71.17,100.95 RP2040.P$36
4V0  (via drill 0.35)
  Top 0.152: VR1.P$1 15.89,64.19 C35.P$2 | VR2.P$1 15.89,80.69 C39.P$2 | VR3.P$1 15.88,97.19 C43.P$2
  Top 0.254: C9.P$2 84.23,86.5 R3.P$2 v83,85.75 | C35.P$2 15.82,63.08 v15.75,63 | C39.P$2 15.82,79.57 v15.75,79.5 | C43.P$2 15.81,96.06 v15.75,96 | v28.88,112.75 53.12,112.75 53.75,113.38 61.5,113.38 v62.88,112 | v66.25,112 69.68,108.57 RP2040.P$39
  Top 0.508: RP2040.P$39 76.94,108.57 C29.P$2 78.86,108.52 C28.P$2 85.84,108.53 90.5,103.88 v90.5,100.5 90.5,100
  Bottom 0.254: v83,85.75 84.38,87.12 86.88,87.12 87.88,86.12 89.25,86.12 92.5,89.38 92.5,98.5 v90.5,100.5 | v15.75,63 v15.75,79.5 v15.75,96 15.75,110.88 17.62,112.75 v28.88,112.75 | v62.88,112 v66.25,112
  pour Top (no thermals): 89.55,100.07 89.55,99.1 89.3,98.85 89.3,94.3 91.7,94.3 91.7,98.73 91.45,98.98 91.45,100.07
12V0  (via drill 0.35, 0.5)
  Top 0.254: R1.P$2 v83,90.62
  Top 0.508: U2.P$1 19.3,38.3 19.09,38.09 C22.P$2 | C22.P$2 19.09,36.41 19.23,36.27 C23.P$2 | C24.P$2 19.09,23.41 19.23,23.27 C25.P$2 | U3.P$1 19.3,25.3 19.09,25.09 C24.P$2 | U4.P$1 19.3,12.3 19.09,12.1 C26.P$2 | C26.P$2 19.09,10.4 19.25,10.25 19.25,9.77 C27.P$2 | C26.P$2 18,11.25 17.38,11.88 17.38,25 | 17.38,25 17.38,38 | C22.P$2 18.12,37.25 17.38,38 | C24.P$2 18.12,24.25 17.38,25 | 17.38,38 17.38,52.88 v19.25,54.75
  Bottom 0.254: v83,90.62 84.75,88.88 87.62,88.88 88.5,88 v88.5,87
  Bottom 0.508: v19.25,54.75 33.5,54.75 39.5,60.75 68.38,60.75 72.62,56.5 92.75,56.5 C12.+
  pour Top (no thermals): 91.68,56.6 91.68,54.6 91.27,54.2 88.3,54.2 88.3,50.93 89.35,50.93 89.98,51.55 92.73,51.55 93.82,52.65 93.82,55.77 98.07,60.02 98.07,73.98 89.7,82.35 89.7,84.85 89.45,85.1 89.45,87.35 89.23,87.57 87.3,87.57 87.3,87.43 87.9,87.43 88.05,87.27 88.05,87.1 87.8,86.85 87.8,83.98 87.55,83.73 87.55,81.4 95.93,73.02 95.93,60.85
AC_L
  Top 0.635: F1.P$2 F1.P$1 107.25,22.12 108,21.38 AC.P$2
  pour Top (no thermals): 71.3,12.63 72.7,12.63 76.8,16.73 76.85,16.75 108.45,16.75 109.25,17.55 109.25,18.57 108.45,19.37 75.3,19.37 70.63,14.7 70.63,13.3
  pour Bottom (no thermals): 76.8,16.73 76.85,16.75 108.45,16.75 109.25,17.55 109.25,18.57 108.45,19.37 75.3,19.37 70.63,14.7 70.63,13.3 71.3,12.63 72.7,12.63
AC_N
  Top 0.635: BR1.P$3 81.02,30.5 PS1.P$2 85.5,30.5 88.75,33.75 88.75,36.88 95.25,43.38 102.12,43.38 103.5,42 C14.P$1 C15.P$1 C16.P$1
  pour Top (no thermals): 67.77,12.18 67.75,12.22 67.75,15.65 67.77,15.7 73.12,21.05 73.12,21.95 72.45,22.62 71.55,22.62 65.5,16.57 65.5,11.05 68.8,7.75 104.57,7.75 109.25,12.43 109.25,13.45 108.45,14.25 107.55,14.25 103.32,10.02 103.28,10 69.97,10 69.93,10.02
  pour Bottom (no thermals): 67.77,12.18 67.75,12.22 67.75,15.65 67.77,15.7 73.12,21.05 73.12,21.95 72.45,22.62 71.55,22.62 65.5,16.57 65.5,11.05 68.8,7.75 104.57,7.75 109.25,12.43 109.25,13.45 108.45,14.25 107.55,14.25 103.32,10.02 103.28,10 69.97,10 69.93,10.02
D1
  Top 0.152: H4.P$2 R10.P$2 12.12,100.75 12.75,101.38 12.75,106.4 16.97,110.62 39.4,110.62 43.62,106.4 43.62,103.25 48.47,98.41 RP2040.P$6
D2
  Top 0.152: H5.P$2 R11.P$2 12.5,93.5 13.12,94.12 13.12,106.25 17.13,110.25 39.25,110.25 43.25,106.25 43.25,100.12 47.51,95.87 RP2040.P$7
D3
  Top 0.152: H6.P$2 R12.P$2 12.88,86.25 13.5,86.88 13.5,106.09 17.28,109.88 39.09,109.88 42.88,106.09 42.88,95.62 47.71,90.79 RP2040.P$9
D4
  Top 0.152: H7.P$2 R13.P$2 13.25,79 13.88,79.62 13.88,105.94 17.44,109.5 38.94,109.5 42.5,105.94 42.5,93.25 47.5,88.25 RP2040.P$10
D5
  Top 0.152: H8.P$2 R14.P$2 13.5,71.75 14.25,72.5 14.25,105.78 17.59,109.12 38.78,109.12 42.12,105.78 42.12,90.12 46.54,85.71 RP2040.P$11
D6
  Top 0.152: H9.P$2 R15.P$2 13.12,64.5 14.62,66 14.62,105.62 17.75,108.75 38.62,108.75 41.75,105.62 41.75,87.12 45.7,83.17 RP2040.P$12
GND  (via drill 0.35, 1)  (1 unrouted)
  Top 0.152: D2.P$1 D1.P$1 84.25,110 83.88,109.62 75.12,109.62 | A1L.P$1 17.8,60.75 17.05,61.5 17.05,62.75 17.3,63 17.3,64.12 | VR1.P$3 17.2,64.19 C35.P$1 17.3,64.12 | 17.3,64.12 17.8,64.12 18.17,63.75 A0L.P$1 | C33.P$1 17.55,70.25 17.39,70.09 C34.P$1 17.8,68.72 17.8,66.88 17.2,66.28 | A2L.P$1 23.38,60.75 | A1L1.P$1 17.79,77.25 17.04,78 17.04,79.25 17.29,79.5 17.29,80.62 | VR2.P$3 17.19,80.69 C39.P$1 17.29,80.62 | 17.29,80.62 17.79,80.62 18.16,80.25 A0L1.P$1 | C37.P$1 17.54,86.75 17.39,86.59 C38.P$1 17.79,85.22 17.79,83.38 17.19,82.78 | A2L1.P$1 23.38,77.25 | A1L2.P$1 17.79,93.75 17.04,94.5 17.04,95.75 17.29,96 17.29,97.12 | VR3.P$3 17.18,97.19 C43.P$1 17.29,97.12 | 17.29,97.12 17.79,97.12 18.16,96.75 A0L2.P$1 | C41.P$1 17.54,103.25 17.38,103.09 C42.P$1 17.79,101.72 17.79,99.88 17.18,99.28 | A2L2.P$1 23.38,93.75 | A3L.P$1 23.38,63.75 | A3L1.P$1 23.38,80.25 | A3L2.P$1 23.38,96.75 | U7.P$1 21.41,102.41 21.62,102.62 23.38,102.62 | U6.P$1 21.41,85.92 21.62,86.12 23.38,86.12 | U5.P$1 21.42,69.42 21.62,69.62 23.38,69.62 | R15.P$1 v11.5,62.62 | R14.P$1 v11.5,69.88 | R13.P$1 v11.5,77.12 | R12.P$1 v11.5,84.38 | R11.P$1 v11.5,91.62 | R10.P$1 v11.5,98.88 | 16.54,99.34 16.5,99.38 | 16.54,82.83 16.5,82.88 | 16.55,66.33 16.5,66.38
  Top 0.254: C8.P$1 C7.P$1 92.88,85.75 | R2.P$1 81.75,92 | R4.P$2 81.75,85.12 | C18.P$1 C17.P$1 89.98,50.73 85.75,46.5 PS1.P$5 | 17.2,66.28 VR1.P$3 | 17.19,82.78 VR2.P$3 | 17.18,99.28 VR3.P$3 | VR3.P$2 16.54,99.34 | VR2.P$2 16.54,82.83 | VR1.P$2 16.55,66.33
  Top 0.508: C29.P$1 77,106.88 77.25,106.62 78.78,106.62 C28.P$1 80.28,106.72 81,106 81,103.5 | C31.P$1 94,99.75 94.5,99.25 94.5,98 | C2.P$1 94.5,98 | 94.5,98 94.5,94.75 92.5,92.75 | 92.5,92.75 88.12,92.75 | C4.P$1 92.25,84 92.88,84.62 92.88,85.75 92.88,92.38 92.5,92.75 | Q1.S 22.91,38.96 21.62,40.25 21.12,40.25 | 21.12,40.25 20.62,40.25 20.25,39.88 U2.P$2 20.25,38.38 20.91,37.72 C22.P$1 20.91,36.39 C23.P$1 | U2.P$4 21.2,40.33 21.12,40.25 | Q2.S 22.91,25.96 21.62,27.25 21.12,27.25 | 21.12,27.25 20.62,27.25 20.25,26.88 U3.P$2 20.25,25.38 20.91,24.72 C24.P$1 20.91,23.39 C25.P$1 | U3.P$4 21.2,27.32 21.12,27.25 | Q3.S 22.91,12.96 21.62,14.25 21.12,14.25 | 21.12,14.25 20.62,14.25 20.25,13.88 U4.P$2 20.25,12.38 20.91,11.72 C26.P$1 20.91,10.39 C27.P$1 | U4.P$4 21.2,14.32 21.12,14.25
  Top 0.635: C12.- 84,61.25 | 84,61.25 C11.- 74.75,52 74.75,46.5 | 84,61.25 84,64.25
  Top 1.27: PS1.P$5 74.75,46.5 C13.P$2 73.5,45.25 69,45.25 67,47.25 67,59.88
  Bottom 0.152: v11.5,62.62 v11.5,69.88 v11.5,77.12 v11.5,84.38 v11.5,91.62 v11.5,98.88
  Bottom 0.381: v11.5,62.62 17.14,56.99 DISP1.P$20 30.11,56.99 30.12,57
  other vias: 85.5,86.25 85.5,85.25 85.5,84.25 84.5,84.25 83.5,84.25 82.5,84.25 84.5,83.25 83.5,83.25 82.5,83.25 81.5,84.25 81.5,83.25 84.5,82.25 83.5,82.25 82.5,82.25 81.5,82.25 84.5,81.25 83.5,81.25 82.5,81.25 81.5,81.25 85.5,81.25 86.5,81.25 86.75,89.75 87.75,89.75 85.75,89.75 86.75,90.75 86.75,91.75 86.75,92.75 87.75,90.75 87.75,91.75 87.75,92.75 85.75,92.75 85.75,91.75 85.75,90.75 84.75,90.75 84.75,91.75 84.75,92.75 83.75,92.75 83.75,91.75 87.75,93.75 86.75,93.75 85.75,93.75 84.75,93.75 83.75,93.75 82.75,92.75 88,72 86,72 84,72 82,72 80,72 78,72 78,74 80,74 82,74 84,74 86,74 88,74 88,76 86,76 84,76 82,76 80,76 78,76 78,78 80,78 82,78 84,78 86,78 88,78 88,80 86,80 84,80 82,80 80,80 80,82 80,84 78,84 78,82 78,80 78,94 80,94 82,94 82,96 80,96 78,96 78,98 80,98 82,98 84,98 86,98 86,96 84,96 86,100 88,102 88,100 86,102 84,102 84,100 82,100 82,102 80,102 80,100 78,100 78,102 30.25,46.25 30.25,44 30.25,41.75 30.25,39.5 30.25,37.25 30.25,35 30.25,32.75 30.25,30.5 30.25,28.25 30.25,26 30.25,23.75 30.25,21.5 30.25,19.25 30.25,17 30.25,14.75 56.5,58.25 54.75,58.25 53,58.25 51.25,58.25 49.5,58.25 47.75,58.25 46,58.25 44.25,58.25 42.5,58.25 40.75,58.25 24,62 26,62 24,64 26,64 26,66 24,66 24,68 26,68 26,70 24,70 24,72 26,72 24,74 26,74 24,76 24,78 24,80 24,82 24,84 24,86 26,86 24,88 26,88 26,90 24,90 24,92 26,92 24,94 26,94 26,96 24,96 24,98 26,98 24,100 26,100 24,102 26,102 26,104 24,104 32.5,94 90,74 90,76 90,78 92,76 94,74 94,72 92,72 92,74 90,72 24,106 26,106 24,108 26,108
  pour Top (no thermals): 84.93,86.35 84.93,85.73 84.4,85.2 78.15,85.2 77.68,84.73 77.68,64.77 78.15,64.3 94.98,64.3 95.45,64.77 95.45,72.85 86.45,81.85 86.45,83.4 87.2,84.15 87.2,86.85 86.95,87.1 86.95,88.9 87.1,89.05 87.9,89.05 88.05,88.9 88.05,88.73 87.9,88.57 87.3,88.57 87.3,88.43 88.1,88.43 88.57,88.9 88.57,89.6 88.2,89.98 88.2,98.65 88.95,99.4 88.95,103.1 88.48,103.57 78.15,103.57 77.68,103.1 77.68,92.4 78.15,91.93 83.02,91.93 83.8,91.15 83.8,90.02 85.4,88.43 86.2,88.43 86.2,88.57 85.6,88.57 85.45,88.73 85.45,88.9 85.6,89.05 86.4,89.05 86.55,88.9 86.55,87.1 86.4,86.95 85.52,86.95
  pour Bottom (no thermals): 78.18,71.13 96.95,71.13 97.37,71.55 97.37,103.07 96.95,103.5 78.18,103.5 77.75,103.07 77.75,71.55
  pour Bottom (no thermals): 26.61,11.57 26.63,11.53 26.63,2.05 27.05,1.63 48.2,1.63 48.62,2.05 48.62,42.82 45.45,46 31.22,46 31.18,46.02 31.14,46.05 31.12,46.1 31.12,46.32 30.57,46.87 29.93,46.87 29.38,46.32 29.38,46.1 29.36,46.05 29.32,46.02 29.28,46 27.05,46 26.63,45.57 26.63,40.35 26.61,40.3 26.07,39.77 26.03,39.75 22.93,39.75 22.5,39.32 22.5,38.55 22.93,38.13 26.03,38.13 26.07,38.11 26.61,37.57 26.63,37.53 26.63,27.35 26.61,27.3 26.07,26.77 26.03,26.75 22.93,26.75 22.5,26.32 22.5,25.68 23.05,25.13 26.03,25.13 26.07,25.11 26.61,24.57 26.63,24.53 26.63,14.35 26.61,14.3 26.07,13.77 26.03,13.75 22.93,13.75 22.5,13.32 22.5,12.68 23.05,12.13 26.03,12.13 26.07,12.11
  pour Top (no thermals): 40.3,57.36 40.35,57.38 56.82,57.38 57.37,57.93 57.37,58.57 56.82,59.12 39.43,59.12 29.38,49.07 29.38,14.55 29.93,14 30.57,14 31.12,14.55 31.12,48.15 31.14,48.2
  pour Bottom (no thermals): 58.86,55.45 58.88,55.4 58.88,32.93 63.8,28 72.45,28 73,28.55 73,29.45 72.45,30 64.6,30 64.55,30.02 60.64,33.93 60.62,33.97 60.62,56.32 57.82,59.12 40.43,59.12 39.88,58.57 39.88,57.93 40.43,57.38 56.9,57.38 56.95,57.36
  pour Top (no thermals): 18.27,65.67 22.9,65.67 23.43,65.15 23.43,60.52 23.65,60.3 29.95,60.3 29.95,108.45 23.9,108.45 23.43,107.98 23.43,101.6 22.9,101.08 18.77,101.08 17.52,99.83 15.05,99.83 15.05,99.42 17.52,99.42 18.27,98.67 22.9,98.67 23.43,98.15 23.43,85.1 22.9,84.58 18.77,84.58 17.52,83.33 15.05,83.33 15.05,82.92 17.52,82.92 18.27,82.17 22.9,82.17 23.43,81.65 23.43,68.6 22.9,68.08 18.77,68.08 17.52,66.83 15.05,66.83 15.05,66.42 17.52,66.42
  pour Bottom: 25.06,75.83 25.05,75.86 25.05,84.02 25.06,84.04 26.42,85.41 26.42,108.72 26.22,108.92 12.78,108.92 12.58,108.72 12.58,62.41 14.66,60.33 26.22,60.33 26.42,60.53 26.42,74.47
  pour Top (no thermals): 30.4,55.55 34.6,55.55 38.98,59.92 74.6,59.92 75.08,60.4 75.08,113.1 74.35,113.83 30.77,113.83 29.93,112.98 29.93,56.02
  pour Bottom: 30.45,55.69 34.55,55.69 38.89,60.04 38.96,60.07 74.55,60.07 74.93,60.45 74.93,113.05 74.3,113.68 30.83,113.68 30.07,112.92 30.07,56.08
LI1
  Top 0.254: U2.P$3 22.52,37.62 25.62,37.62 26.25,38.25 26.25,50.88 53.47,78.09 RP2040.P$14
LI2
  Top 0.254: U3.P$3 22.65,24.5 26.12,24.5 27.12,25.5 27.12,50.5 52.17,75.55 RP2040.P$15
LI3
  Top 0.254: U4.P$3 22.65,11.5 26.88,11.5 28,12.62 28,50.12 50.88,73.01 RP2040.P$16
LO1
  Top 0.508: R5.P$2 23.96,44 Q1.G
LO2
  Top 0.508: R6.P$2 23.96,31 Q2.G
LO3
  Top 0.508: R7.P$2 23.96,18 Q3.G
N$1
  pour Bottom (no thermals): 19.43,42.25 17.32,40.14 17.28,40.12 6.55,40.12 5.75,39.32 5.75,38.43 6.55,37.63 18.82,37.63 21.93,40.73 21.97,40.75 25.07,40.75 25.5,41.18 25.5,41.82 25.07,42.25
N$2
  Top 0.254: R2.P$2 R1.P$1 84.38,88.75 85.12,88 U1.P$5
N$3
  Top 0.635: PS1.P$3 68,34.5 C10.+
N$4
  Top 0.635: C10.- 69,38.5 C13.P$1 PS1.P$4
N$5
  pour Bottom (no thermals): 19.43,29.25 17.32,27.14 17.28,27.12 6.55,27.12 5.75,26.32 5.75,25.43 6.55,24.63 18.82,24.63 21.93,27.73 21.97,27.75 25.07,27.75 25.5,28.18 25.5,28.82 25.07,29.25
N$6
  Top 0.635: C11.+ L2.P$1
  pour Top (no thermals): 81.26,49.32 81.74,49.32 83.56,51.13 83.63,51.17 83.71,51.19 85.93,51.19 85.93,53.81 83.38,53.81 80.69,51.12 80.69,49.88
N$7
  Top 0.152: R8.P$2 84.2,113.25 D1.P$2
N$8
  Top 0.635: R17.P$2 100.25,52.62 101.12,53.5 105.75,53.5 107.25,52 F1.P$3 F1.P$4
N$9
  Top 0.254: U1.P$6 84.27,87.5 C9.P$1 83.02,87.52 R3.P$1 R4.P$1
N$10
  Top 0.635: R17.P$1 100.25,38.12 99.25,37.12 97.12,37.12 C14.P$2 C15.P$2 C16.P$2 96,25.5 L3.P$1
N$11
  Top 0.635: PS1.P$1 87,26.5 L3.P$2
N$12
  pour Bottom (no thermals): 19.43,16.25 17.32,14.14 17.28,14.12 6.55,14.12 5.75,13.32 5.75,12.43 6.55,11.63 18.82,11.63 21.93,14.73 21.97,14.75 25.07,14.75 25.5,15.18 25.5,15.82 25.07,16.25
N$13
  Top 0.152: R9.P$2 86.8,113.25 D2.P$2
N$14
  pour Top (no thermals): 58.97,5 58.93,5.02 54.52,9.43 54.5,9.47 54.5,43.82 53.82,44.5 53.05,44.5 52.5,43.95 52.5,8.55 58.05,3 72.45,3 73,3.55 73,4.45 72.45,5
  pour Bottom (no thermals): 52.48,42.82 52.5,42.78 52.5,8.55 58.05,3 72.45,3 73,3.55 73,4.45 72.45,5 58.97,5 58.93,5.02 54.52,9.43 54.5,9.47 54.5,43.82 44.82,53.5 5.43,53.5 0.88,48.95 0.88,22.18 6.43,16.63 7.57,16.63 8.37,17.43 8.37,18.57 3.27,23.68 3.25,23.72 3.25,32.65 3.27,32.7 3.3,32.73 3.35,32.75 3.4,32.75 3.45,32.73 6.43,29.75 7.57,29.75 8.25,30.43 8.25,31.57 3.27,36.55 3.25,36.6 3.25,47.65 3.27,47.7 3.3,47.73 3.35,47.75 3.4,47.75 3.45,47.73 5.73,45.45 5.75,45.4 5.75,43.43 6.43,42.75 7.57,42.75 8.25,43.43 8.25,46.32 5.16,49.41 5.16,49.41 5.15,49.42 5.13,49.44 5.13,49.44 5.13,49.44 5.12,49.46 5.11,49.49 5.11,49.49 5.11,49.49 5.11,49.51 5.11,49.54 5.11,49.54 5.11,49.54 5.12,49.56 5.13,49.58 5.13,49.59 5.13,49.59 5.15,49.6 5.17,49.62 5.17,49.62 7.04,51.46 7.05,51.48 7.05,51.48 7.05,51.48 7.08,51.49 7.1,51.5 7.1,51.5 7.1,51.5 7.13,51.5 43.78,51.5 43.82,51.48
N$15  (via drill 0.35)
  Top 0.152: RP2040.P$5 67.42,100.95 v68.88,99.5 | v82.5,111 R8.P$1
  Bottom 0.152: v68.88,99.5 68.88,110.5 71.5,113.12 78.38,113.12 80.5,111 v82.5,111
N$16
  Top 0.508: R6.P$1 19.75,30 19.3,29.55 U3.P$5
N$17
  Top 0.508: R5.P$1 19.75,43 19.3,42.55 U2.P$5
N$18  (via drill 0.35)
  Top 0.152: RP2040.P$4 66.01,103.49 v70,99.5 | v88.5,111 R9.P$1
  Bottom 0.152: v70,99.5 70,110.38 72,112.38 78.25,112.38 80.38,110.25 87.75,110.25 v88.5,111
N$19
  Top 0.152: U5.P$6 A0L.P$2 A0H.P$1
N$20
  Top 0.152: A1L.P$2 A1H.P$1 20,61.83 20,64.25 19.92,64.33 U5.P$7
N$21
  Top 0.508: R7.P$1 19.75,17 19.3,16.55 U4.P$5
N$22
  Top 0.152: A2L.P$2 A2H.P$1 20.38,62.3 20.38,64.25 20.42,64.3 U5.P$8
N$23
  Top 0.152: U5.P$9 A3L.P$2 A3H.P$1
N$24
  Top 0.152: U6.P$6 A0L1.P$2 A0H1.P$1
N$25
  Top 0.152: A1L1.P$2 A1H1.P$1 20,78.33 20,80.75 19.91,80.83 U6.P$7
N$26
  Top 0.152: A2L1.P$2 A2H1.P$1 20.38,78.79 20.38,80.75 20.41,80.79 U6.P$8
N$27
  Top 0.152: U6.P$9 A3L1.P$2 A3H1.P$1
N$28
  Top 0.152: VR1.P$5 15.89,69.07 C34.P$2 15.95,70.16 16.8,71 19.05,71 19.17,70.88 19.17,70.27 C33.P$2 19.18,70.19 19.92,69.45 U5.P$4
N$29
  Top 0.152: 19.16,86.77 C37.P$2 | VR2.P$5 15.89,85.57 C38.P$2 15.95,86.66 16.79,87.5 19.04,87.5 19.16,87.38 19.16,86.77 | U6.P$4 19.91,85.96 19.16,86.71 19.16,86.77
N$30
  Top 0.152: U7.P$6 A0L2.P$2 A0H2.P$1
N$31
  Top 0.152: A1L2.P$2 A1H2.P$1 20,94.84 20,97.25 19.91,97.34 U7.P$7
N$32
  Top 0.152: A2L2.P$2 A2H2.P$1 20.38,95.28 20.38,97.25 20.41,97.28 U7.P$8
N$33
  Top 0.152: U7.P$9 A3L2.P$2 A3H2.P$1
N$34
  Top 0.152: 19.16,103.27 C41.P$2 | VR3.P$5 15.88,102.07 C42.P$2 15.94,103.16 16.79,104 19.04,104 19.16,103.88 19.16,103.27 | U7.P$4 19.88,101.83 19.88,102.5 19.16,103.22 19.16,103.27
OUT
  pour Top (no thermals): 89.3,91.2 89.3,89.23 88.15,88.07 87.3,88.07 87.3,87.93 90.35,87.93 91.7,89.27 91.7,91.2
SPI_CLK  (via drill 0.35)
  Top 0.152: v34.88,78.38 34.88,71.48 DISP1.P$17
  Bottom 0.152: RP2040.P$24 66,77.36 66,105.44 58.31,113.12 43.56,113.12 36,105.56 36,79.5 v34.88,78.38
SPI_CS
  Bottom 0.152: RP2040.P$22 65.62,72.66 65.62,105.28 58.16,112.75 43.72,112.75 36.38,105.41 36.38,78.23 30.38,72.23 DISP1.P$14
SPI_DS
  Bottom 0.152: RP2040.P$26 66.75,81.69 66.75,105.75 58.62,113.88 43.25,113.88 35.25,105.87 35.25,90.88 29.3,84.93 DISP1.P$9 26.55,84.93 25.5,83.88 25.5,76 26.73,74.77 DISP1.P$13
SPI_RX
  Bottom 0.152: RP2040.P$21 65.25,70.49 65.25,105.12 58,112.38 43.88,112.38 36.75,105.25 36.75,71.12 32.77,67.15 DISP1.P$16
SPI_TX  (via drill 0.35)
  Top 0.152: v34,79.75 34,75.69 DISP1.P$15
  Bottom 0.152: RP2040.P$25 66.38,79.53 66.38,105.59 58.47,113.5 43.41,113.5 35.62,105.72 35.62,81.38 v34,79.75
T1+
  Top 0.152: U5.P$3 20.42,69.5 20.16,69.77 C32.P$2 20.16,73.72 H10.P$2
T1-
  Top 0.152: U5.P$2 20.92,69.5 21.18,69.77 C32.P$1 21.18,73.31 H10.P$1
T2+
  Top 0.152: U6.P$3 20.41,86 20.15,86.27 C36.P$2 20.15,90.47 H11.P$2
T2-
  Top 0.152: U6.P$2 20.91,86 21.18,86.27 C36.P$1 21.18,90.06 H11.P$1
T3+
  Top 0.152: U7.P$3 20.41,102.5 20.14,102.77 C40.P$2 20.14,106.73 H12.P$2
T3-
  Top 0.152: U7.P$2 20.91,102.5 21.18,102.77 C40.P$1 21.18,106.3 H12.P$1
X-
  Bottom 0.152: RP2040.P$32 67.88,95.81 67.88,106.21 59.09,115 42.79,115 34.12,106.34 34.12,94.12 30.01,90.01 DISP1.P$7
Y+  (via drill 0.35)
  Top 0.152: v32.5,91.62 32.5,86.89 DISP1.P$10
  Bottom 0.152: RP2040.P$31 67.5,93.64 67.5,106.06 58.93,114.62 42.94,114.62 34.5,106.18 34.5,93.62 v32.5,91.62
Y-
  Bottom 0.152: RP2040.P$27 67.12,83.86 67.12,105.9 58.78,114.25 43.1,114.25 34.88,106.03 34.88,91.25 31.09,87.47 DISP1.P$8

### Text on the board
tPlace: BESPOKE TOAST MAINBOARD / REV 0 2023-01-22